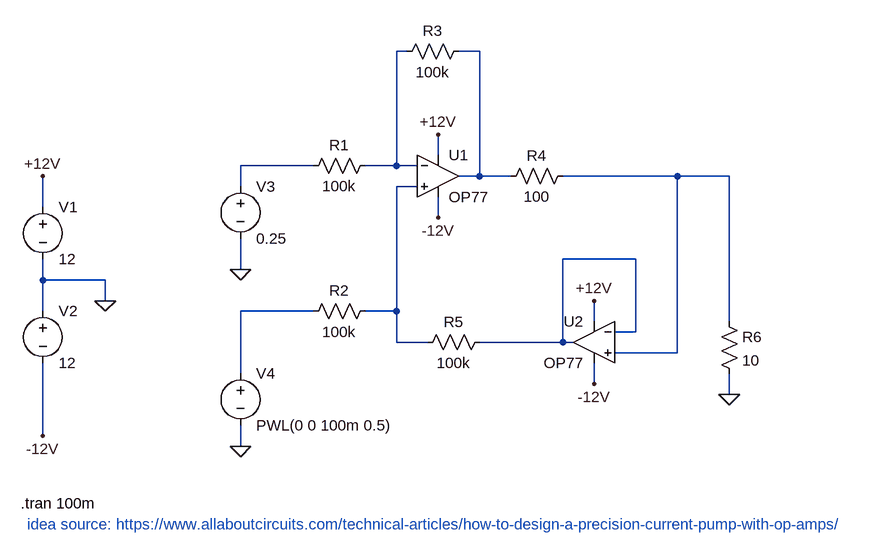
[diagram p0: schematic variableCurrentSource.asc]
variableCurrentSource.asc, the LTspice schematic file:
Version 4
SHEET 1 1560 680
WIRE -16 -144 -32 -144
WIRE 96 -144 64 -144
WIRE 32 16 32 -16
WIRE -160 32 -272 32
WIRE -32 32 -32 -144
WIRE -32 32 -80 32
WIRE 0 32 -32 32
WIRE 96 48 96 -144
WIRE 96 48 64 48
WIRE 144 48 96 48
WIRE 400 48 224 48
WIRE 480 48 400 48
WIRE -272 64 -272 32
WIRE 0 64 -32 64
WIRE -576 96 -576 48
WIRE 32 112 32 80
WIRE 336 176 224 176
WIRE -272 192 -272 144
WIRE -576 208 -576 176
WIRE -480 208 -576 208
WIRE -480 240 -480 208
WIRE -576 256 -576 208
WIRE -160 256 -272 256
WIRE -32 256 -32 64
WIRE -32 256 -80 256
WIRE 272 272 272 240
WIRE 480 272 480 48
WIRE 336 288 336 176
WIRE 336 288 304 288
WIRE -32 304 -32 256
WIRE 16 304 -32 304
WIRE 224 304 224 176
WIRE 224 304 96 304
WIRE 240 304 224 304
WIRE 400 320 400 48
WIRE 400 320 304 320
WIRE -272 352 -272 256
WIRE 272 368 272 336
WIRE 480 384 480 352
WIRE -576 448 -576 336
WIRE -272 464 -272 432
FLAG -480 240 0
FLAG -576 448 -12V
FLAG -576 48 +12V
FLAG 32 -16 +12V
FLAG 32 112 -12V
FLAG 272 240 +12V
FLAG 272 368 -12V
FLAG 480 384 0
FLAG -272 192 0
FLAG -272 464 0
SYMBOL Opamps\\OP77 32 -16 R0
SYMATTR InstName U1
SYMBOL Opamps\\OP77 272 240 M0
SYMATTR InstName U2
SYMBOL voltage -576 80 R0
WINDOW 123 0 0 Left 0
WINDOW 39 0 0 Left 0
SYMATTR InstName V1
SYMATTR Value 12
SYMBOL voltage -576 240 R0
WINDOW 123 0 0 Left 0
WINDOW 39 0 0 Left 0
SYMATTR InstName V2
SYMATTR Value 12
SYMBOL res -64 16 R90
WINDOW 0 0 56 VBottom 2
WINDOW 3 32 56 VTop 2
SYMATTR InstName R1
SYMATTR Value 100k
SYMBOL res -64 240 R90
WINDOW 0 0 56 VBottom 2
WINDOW 3 32 56 VTop 2
SYMATTR InstName R2
SYMATTR Value 100k
SYMBOL res 80 -160 R90
WINDOW 0 0 56 VBottom 2
WINDOW 3 32 56 VTop 2
SYMATTR InstName R3
SYMATTR Value 100k
SYMBOL res 240 32 R90
WINDOW 0 0 56 VBottom 2
WINDOW 3 32 56 VTop 2
SYMATTR InstName R4
SYMATTR Value 100
SYMBOL res 112 288 R90
WINDOW 0 0 56 VBottom 2
WINDOW 3 32 56 VTop 2
SYMATTR InstName R5
SYMATTR Value 100k
SYMBOL res 464 256 R0
SYMATTR InstName R6
SYMATTR Value 10
SYMBOL voltage -272 48 R0
WINDOW 123 0 0 Left 0
WINDOW 39 0 0 Left 0
SYMATTR InstName V3
SYMATTR Value 0.25
SYMBOL voltage -272 336 R0
WINDOW 123 0 0 Left 0
WINDOW 39 0 0 Left 0
SYMATTR InstName V4
SYMATTR Value PWL(0 0 100m 0.5)
TEXT -600 584 Left 2 ;idea source: https://www.allaboutcircuits.com/technical-articles/how-to-design-a-precision-current-pump-with-op-amps/
TEXT -610 552 Left 2 !.tran 100m

The netlist it stands for:
* variableCurrentSource.asc
XU1 N005 N001 +12V -12V N002 OP77  ; pins In+ In- V+ V- OUT
XU2 N004 N006 +12V -12V N006 OP77  ; pins In+ In- V+ V- OUT
V1 +12V 0 12
V2 0 -12V 12
R1 N001 N003 100k
R2 N005 N007 100k
R3 N002 N001 100k
R4 N004 N002 100
R5 N006 N005 100k
R6 N004 0 10
V3 N003 0 0.25
V4 N007 0 PWL(0 0 100m 0.5)
* idea source: https://www.allaboutcircuits.com/technical-articles/how-to-design-a-precision-current-pump-with-op-amps/
.tran 100m
.lib ADI.lib
.backanno
.end